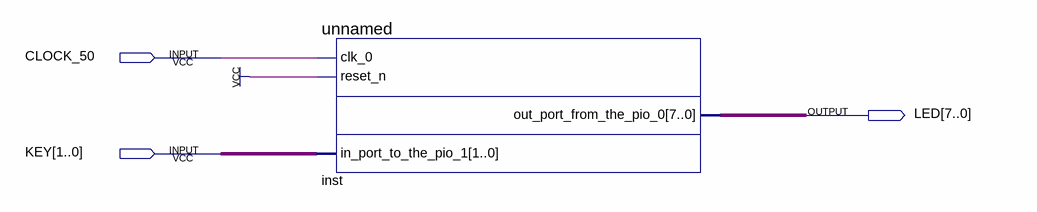
[diagram p0: schematic sheet]
// Quartus schematic mon_sopc.bdf as structural Verilog: 1 symbols, 3 pins
module mon_sopc (
  input  CLOCK_50,
  input  [1:0] KEY,
  output [7:0] LED
);

  unnamed inst (.clk_0(CLOCK_50), .reset_n(1'b1), .in_port_to_the_pio_1(KEY), .out_port_from_the_pio_0(LED));
endmodule
